# EAGLE schematic Headphone-Amplifier-ClassAB-smallest (EAGLE 7.2.0)
4x4 - Three Transistor Headphone Amplifier - Class AB http://www.electronics-diy.com/4x4.php
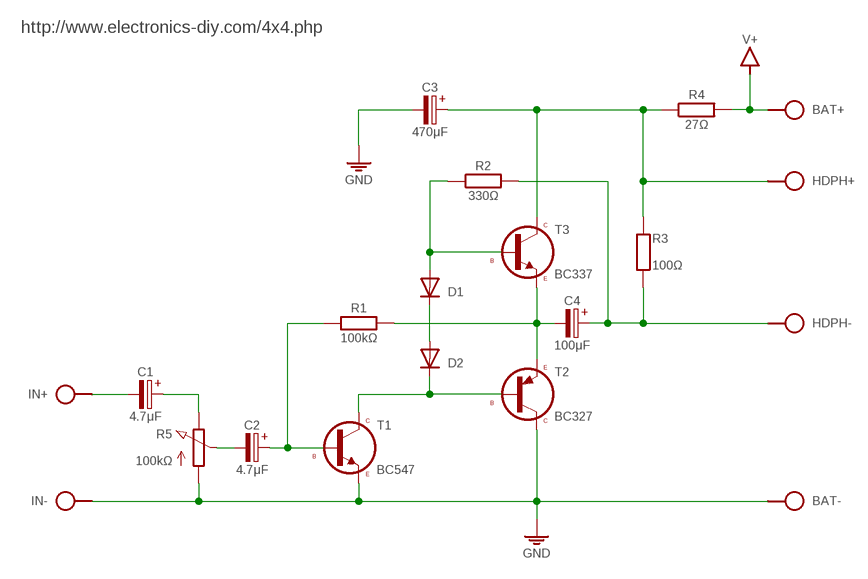
[diagram p0: schematic, sheet 1]

## Parts
BAT  SPAD+-+-  [SPAD+-]
C1  4.7μF  CPOLE2,5-4  [E2,5-4]
C2  4.7μF  CPOLE2,5-4  [E2,5-4]
C3  470μF  CPOLE5-4-R45  [E5-4-R45]
C4  100μF  CPOLE5-4  [E5-4]
D1  1N414834-5V  [DO34-5V]
D2  1N414834-5V  [DO34-5V]
HDPH  SPAD+--+  [SPAD-+]
IN  SPAD+--+  [SPAD-+]
R1  100kΩ  R-H0202/5  [0202/5]
R2  330Ω  R-H0202/7  [0202/7]
R3  100Ω  R0202/7  [0202/7]
R4  27Ω  R-H-V-X  [0204V]
R5  100kΩ  POT-3P  [CONN-3P]
T1  BC547  [TO92]
T2  BC327  [TO92]
T3  BC337  BC337CBE  [TO92-CBE]

## Nets
GND: BAT.1 C3.- IN.1 R5.1(A) T1.3(E) T2.1(C)
N$1: D1.A R2.1 T3.2(B)
N$2: D2.C T1.1(C) T2.2(B)
N$3: D1.C D2.A
N$4: C4.- R1.2 T2.3(E) T3.3(E)
N$5: C1.+ R5.3(E)
N$6: C2.- R5.2(S)
N$7: C2.+ R1.1 T1.2(B)
N$8: C3.+ HDPH.2 R3.2 R4.2 T3.1(C)
N$9: C4.+ HDPH.1 R2.2 R3.1
N$10: C1.- IN.2
V+: BAT.2 R4.1

## Notes on the sheet
- http://www.electronics-diy.com/4x4.php

## Library data of the parts
BAT HDPH IN = pad:SPAD+-
C1-C4 = c:CPOL: POLARIZED CAPACITOR, European symbol
D1 D2 = d:1N4148
R1 R2 R4 = r:R-H
R3 = r:R: RESISTOR, European symbol
R5 = r:POT
T1 = t:BC547
T2 = t:BC327
T3 = t:BC337